# Altium schematic sheet STM_DDS_GPIO.SchDoc: STM DDS GPIO
size A4; DrawnBy: Marin Sinožić; SheetNumber: 3; SheetTotal: 6
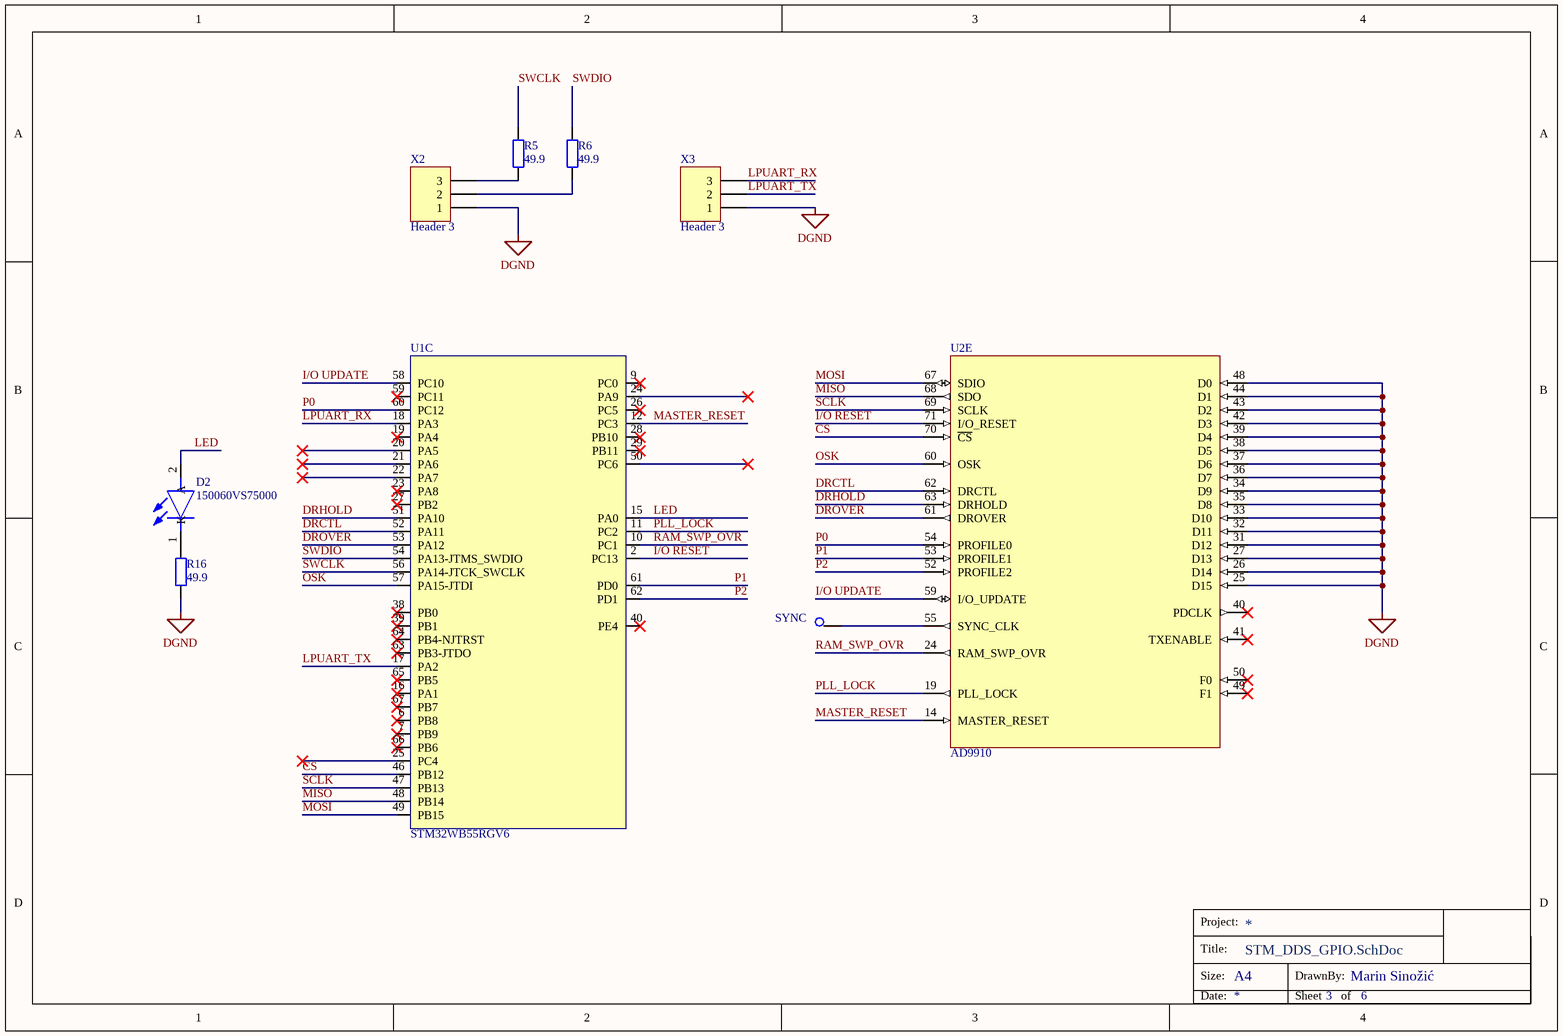
[diagram p0: STM_DDS_GPIO.SchDoc]

## Parts
D2  150060VS75000  [0603]
R5  49.9  [0805]
R6  49.9  [0805]
R16  49.9  [0805]
SYNC  TestPoint  [TP]  (value not drawn)
U1  STM32WB55RGV6  [VFQFPN69]  (part C of 3)
U2  AD9910  [TSQFP50P1600X1600X105_HS-101N]  (part E of 5)
X2  Header 3  [HDR1X3]
X3  Header 3  [HDR1X3]

## Nets
DGND: R16.2 U2.25(D15) U2.26(D14) U2.27(D13) U2.31(D12) U2.32(D11) U2.33(D10) U2.34(D9) U2.35(D8) U2.36(D7) U2.37(D6) U2.38(D5) U2.39(D4) U2.42(D3) U2.43(D2) U2.44(D1) U2.48(D0) X2.1 X3.1
~{CS}: U1.46(PB12) U2.70(~{CS})
DRCTL: U1.52(PA11) U2.62(DRCTL)
DRHOLD: U1.51(PA10) U2.63(DRHOLD)
DROVER: U1.53(PA12) U2.61(DROVER)
I/O RESET: U1.2(PC13) U2.71(I/O_RESET)
I/O UPDATE: U1.58(PC10) U2.59(I/O_UPDATE)
LED: D2.2(A) U1.15(PA0)
LPUART_RX: U1.18(PA3) X3.3
LPUART_TX: U1.17(PA2) X3.2
MASTER_RESET: U1.12(PC3) U2.14(MASTER_RESET)
MISO: U1.48(PB14) U2.68(SDO)
MOSI: U1.49(PB15) U2.67(SDIO)
OSK: U1.57(PA15-JTDI) U2.60(OSK)
P0: U1.60(PC12) U2.54(PROFILE0)
P1: U1.61(PD0) U2.53(PROFILE1)
P2: U1.62(PD1) U2.52(PROFILE2)
PLL_LOCK: U1.11(PC2) U2.19(PLL_LOCK)
RAM_SWP_OVR: U1.10(PC1) U2.24(RAM_SWP_OVR)
SCLK: U1.47(PB13) U2.69(SCLK)
SWCLK: R5.1 U1.56(PA14-JTCK_SWCLK)
SWDIO: R6.1 U1.54(PA13-JTMS_SWDIO)
NetD2_1: D2.1(K) R16.1
NetR5_2: R5.2 X2.3
NetR6_2: R6.2 X2.2
NetSYNC_1: SYNC.1 U2.55(SYNC_CLK)

Not connected (* = marked no-connect by the designer): U1 6(PB8)* 7(PB9)* 9(PC0)* 16(PA1)* 19(PA4)* 20(PA5)* 21(PA6)* 22(PA7)* 23(PA8)* 24(PA9)* 25(PC4)* 26(PC5)* 27(PB2)* 28(PB10)* 29(PB11)* 38(PB0)* 39(PB1)* 40(PE4)* 50(PC6)* 59(PC11)* 63(PB3-JTDO)* 64(PB4-NJTRST)* 65(PB5)* 66(PB6)* 67(PB7)*; U2 40(PDCLK)* 41(TXENABLE)* 49(F1)* 50(F0)*

## Notes on the sheet
- Project:
- Title:
- Size:
- A4
- DrawnBy:
- Date:
- Sheet
- of

## Library data of the parts
D2 = 150060VS75000: LED GREEN DIFFUSED 0603 SMD; Manufacturer Part Number: 732-12017-1-ND; Price: 0.18; Value: *; Supplier 1: Digi-Key
R5 R6 R16 = Res2: RES SMD 49.9 OHM 0.1% 1/10W 0603; Manufacturer Part Number: P49.9DBCT-ND; Value: 49.9; Supplier 1: Digi-Key; Price: 0.32
U1 = STM32WB55RGV6: MCU 32-Bit STM32WB55 ARM Cortex M4 RISC 1MB Flash 1.7V to 3.6V 68-Pin VFQFPN Tray; Manufacturer Part Number: 497-18488-ND; Price: 11.67; Supplier 1: Digi-Key
U2 = AD9910BSVZ: ANALOG DEVICES - AD9910BSVZ - Direct Digital Synthesizer, 1 GSPS. 14 Bit, 3.3 V,; Manufacturer Part Number: 505-AD9910BSVZ-ND; Price: 72.64; Supplier 1: Digi-Key
X2 X3 = Header 3: Header, 3-Pin